# EAGLE design datalogger_v01 (EAGLE 7.2.0)
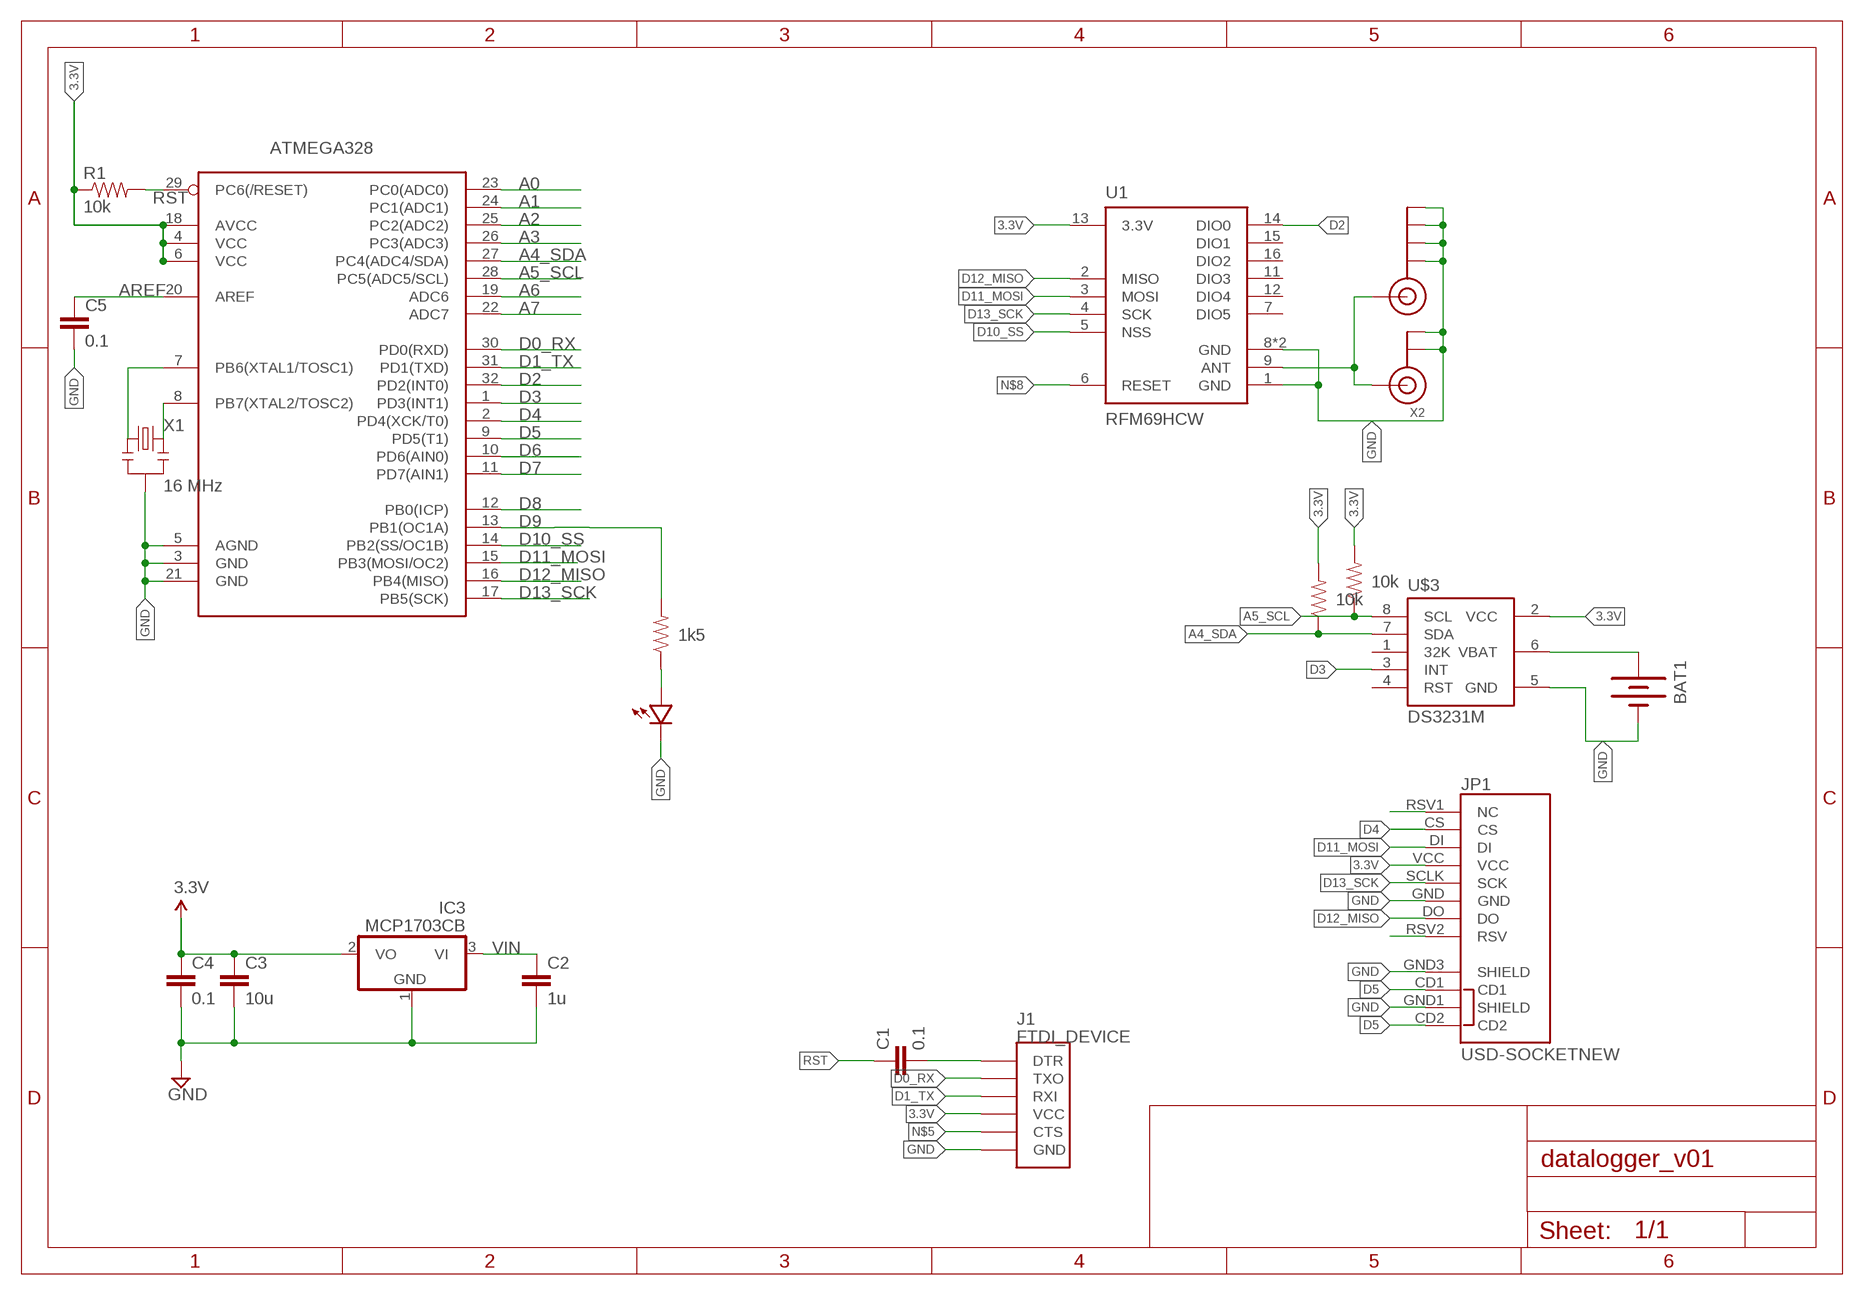
[diagram p0: schematic, sheet 1]

## Parts
ATMEGA328  ATMega-328  ATMEGA168/328TQFP32  [TQFP32-08]
BAT1  BATTERY12MM  [BATTCON_12MM]
C1  0.1  CAP0603-CAP  [0603-CAP]
C2  1u  CAP0603-CAP  [0603-CAP]
C3  10u  CAP0805-CAP  [0805-CAP]
C4  0.1  CAP0603-CAP  [0603-CAP]
C5  0.1  CAP0603-CAP  [0603-CAP]
IC3  MCP1703CB  [SOT23]
J1  FTDI_DEVICE  [FTDI_DEVICE_SIDE]
J$1  SMA_EDGE  [SMA-EDGE]
JP1  USD-SOCKETNEW  [MICRO-SD-SOCKET-PP]
R1  10k  RESISTOR0603-RES  [0603-RES]
R2  1k5  RESISTOR0603-RES  [0603-RES]
R3  10k  RESISTOR0603-RES  [0603-RES]
R4  10k  RESISTOR0603-RES  [0603-RES]
U1  RFM69HCW  [RFM69HCW-XXXS2]
U$2  LED0603  [0603-LED]
U$3  DS3231M  [SO08]
X1  16 MHz  RESONATORSMD  [RESONATOR-SMD]
X2  ANTENNA_U.FL  [U.FL]

## Nets
3.3V: ATMEGA328.4(VCC) ATMEGA328.6(VCC) ATMEGA328.18(AVCC) J1.P$4(VCC) JP1.VCC R1.1 R3.2 R4.2 U1.13(3.3V) U$3.2(VCC)
A0: ATMEGA328.23(PC0(ADC0))
A1: ATMEGA328.24(PC1(ADC1))
A2: ATMEGA328.25(PC2(ADC2))
A3: ATMEGA328.26(PC3(ADC3))
A4_SDA: ATMEGA328.27(PC4(ADC4/SDA)) R4.1 U$3.7(SDA)
A5_SCL: ATMEGA328.28(PC5(ADC5/SCL)) R3.1 U$3.8(SCL)
A6: ATMEGA328.19(ADC6)
A7: ATMEGA328.22(ADC7)
AREF: ATMEGA328.20(AREF) C5.1
D0_RX: ATMEGA328.30(PD0(RXD)) J1.P$2(TXO)
D1_TX: ATMEGA328.31(PD1(TXD)) J1.P$3(RXI)
D2: ATMEGA328.32(PD2(INT0)) U1.14(DIO0)
D3: ATMEGA328.1(PD3(INT1)) U$3.3(INT)
D4: ATMEGA328.2(PD4(XCK/T0)) JP1.CS
D5: ATMEGA328.9(PD5(T1)) JP1.CD1 JP1.CD2
D6: ATMEGA328.10(PD6(AIN0))
D7: ATMEGA328.11(PD7(AIN1))
D8: ATMEGA328.12(PB0(ICP))
D9: ATMEGA328.13(PB1(OC1A)) R2.2
D10_SS: ATMEGA328.14(PB2(SS/OC1B)) U1.5(NSS)
D11_MOSI: ATMEGA328.15(PB3(MOSI/OC2)) JP1.DI U1.3(MOSI)
D12_MISO: ATMEGA328.16(PB4(MISO)) JP1.DO U1.2(MISO)
D13_SCK: ATMEGA328.17(PB5(SCK)) JP1.SCLK(SCK) U1.4(SCK)
GND [power]: ATMEGA328.3(GND) ATMEGA328.5(AGND) ATMEGA328.21(GND) BAT1.GND(-) C2.2 C3.2 C4.2 C5.2 IC3.1(GND) J1.P$6(GND) J$1.GND@0(GND) J$1.GND@1(GND) J$1.GND@2(GND) J$1.GND@3(GND) JP1.GND JP1.GND1(SHIELD) JP1.GND3(SHIELD) U1.1(GND) U1.8(GND) U1.10(GND) U$2.MINUS U$3.5(GND) X1.2 X2.1(GND) X2.2(GND)
N$1: ATMEGA328.7(PB6(XTAL1/TOSC1)) X1.1
N$2: R2.1 U$2.PLUS
N$3: JP1.RSV1(NC)
N$4: C1.2 J1.P$1(DTR)
N$5: J1.P$5(CTS)
N$8: U1.6(RESET)
N$10: BAT1.PWR@1(+) U$3.6(VBAT)
N$11: J$1.SIG(SIGNAL) U1.9(ANT) X2.3(SIGNAL)
N$13: JP1.RSV2(RSV)
N$21: ATMEGA328.8(PB7(XTAL2/TOSC2)) X1.3
RST: ATMEGA328.29(PC6(/RESET)) C1.1 R1.2
VCC: C3.1 C4.1 IC3.2(VO) ; supply symbol labelled 3.3V
VIN: C2.1 IC3.3(VI)
Unconnected: U1.7(DIO5) U1.11(DIO3) U1.12(DIO4) U1.15(DIO1) U1.16(DIO2) U$3.1(32K) U$3.4(RST)

## Library data of the parts
ATMEGA328 = LowPowerLab:ATMEGA168/328: Atmel 32-pin 8-bit micro, 16k flash.
BAT1 = SparkFun-Electromechanical:BATTERY: Battery Holders Various common sizes : AA, AAA, 18650 (PRT-12895), 20mm coin cell and 12mm coin cell. 20MM_4LEGS, BATT-10373; PROD_ID: BATT-08044
C1-C5 = LowPowerLab:CAP: Capacitor Standard 0603 ceramic capacitor, and 0.1" leaded capacitor.
IC3 = linear:MCP1703: 250 mA, 16V, Low Quiescent Current LDO Regulator Source: http://ww1.microchip.com/downloads/en/DeviceDoc/22049b.pdf
J1 = SparkFun-Connectors:FTDI_DEVICE: Connector which mates to FTDI basic or FTDI cable.
J$1 = SparkFun-Connectors:SMA_EDGE: SMA Antenna Connector End launch SMA connector. The paste layer has been removed so that the connector can be hand soldered onto the board after reflow.
JP1 = SparkFun-Connectors:USD-SOCKET: microSD Socket Push-push type uSD socket. Schematic element and footprint production proven. Spark Fun Electronics SKU : PRT-00127. tDoc lines correctly indicate media card edge positions when inserting (unlocked, locked, depressed). NOTE: CD1 and CD2 are connected internally; PROD_ID: CONN-07820
R1-R4 = LowPowerLab:RESISTOR: Resistor Basic schematic elements and footprints for 0603, 1206, and PTH resistors.
U1 = SparkFun-RF:RFM69H; PROD_ID: IC-11997, IC-12053
U$2 = LowPowerLab:LED
U$3 = _my-parts:DS3231M: The DS3231M is a low-cost, extremely accurate, I2C realtime clock (RTC). Datasheet <https://datasheets.maximintegrated.com/en/ds/DS3231M.pdf>
X1 = SparkFun:RESONATOR: Resonator Small SMD resonator. This is the itty bitty 10/20MHz resonators with built in caps. CSTCE10M0G55 and CSTCE20M0V53. Footprint has been reviewed closely but hasn't been tested yet.
X2 = adafruit:ANTENNA_U.FL: U.FL Antenna Connector

## Net classes
1 power: width 0.381 mm, clearance 0.254 mm

## Board
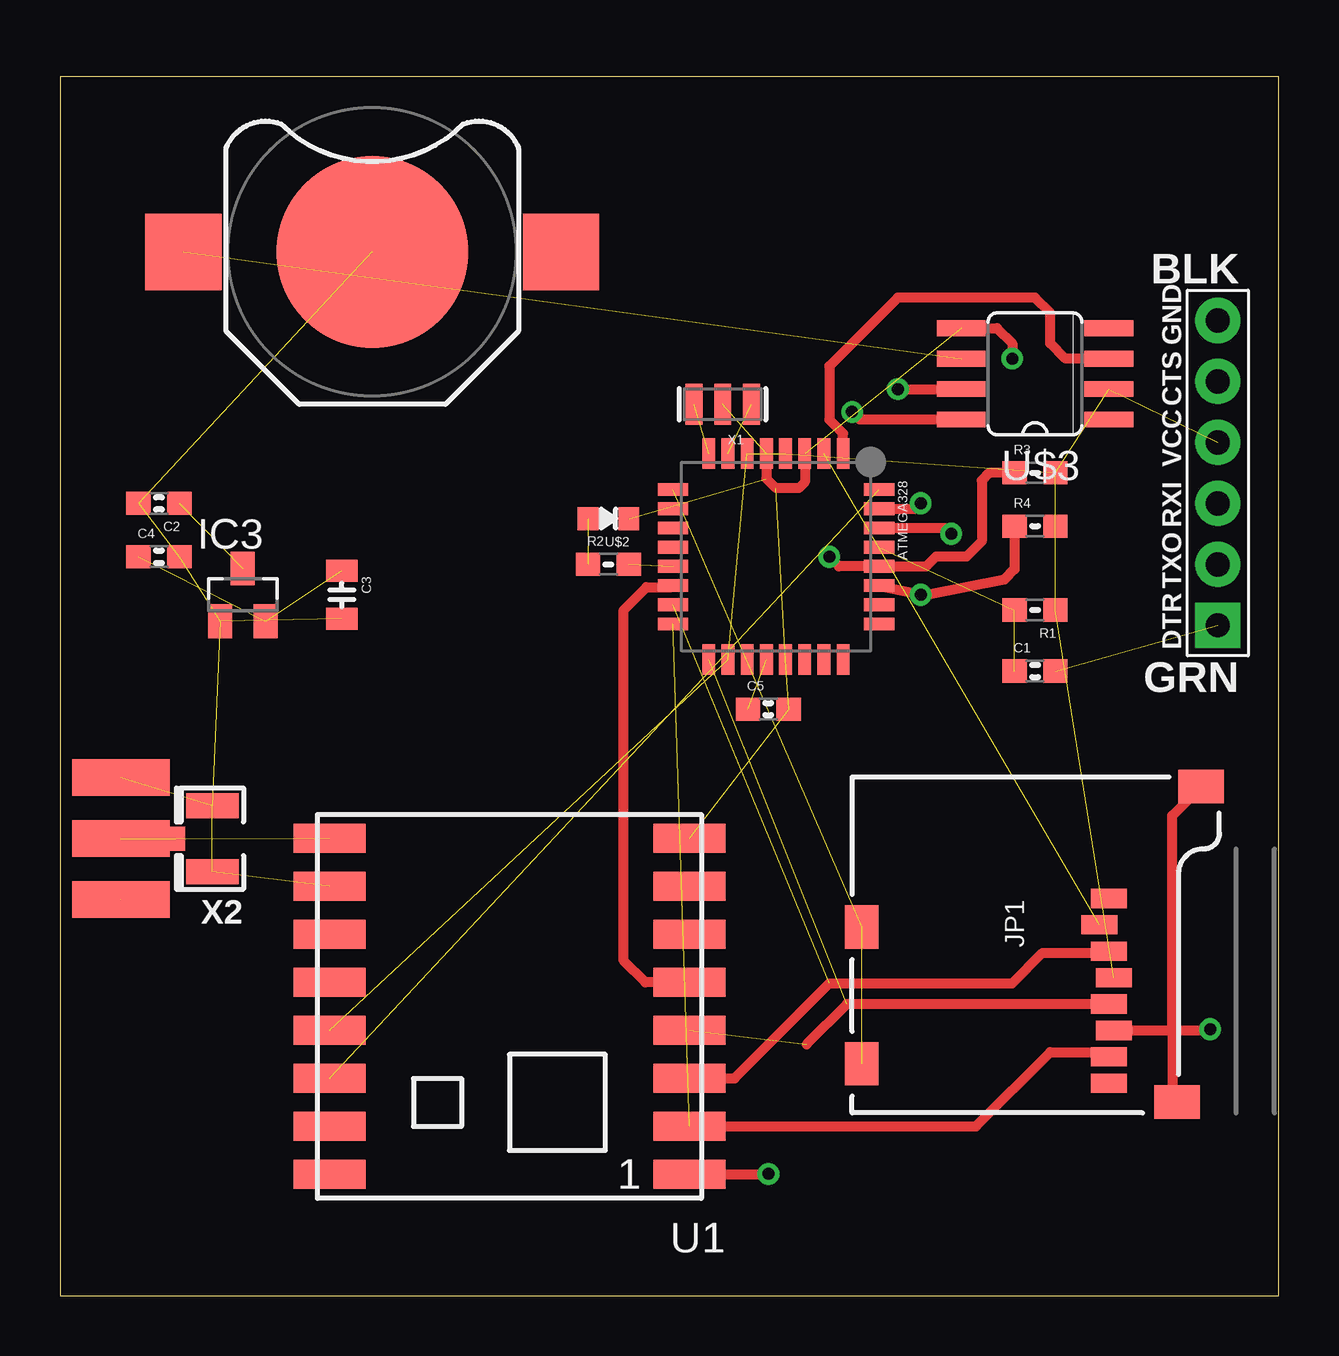
[diagram p1: board, top side]
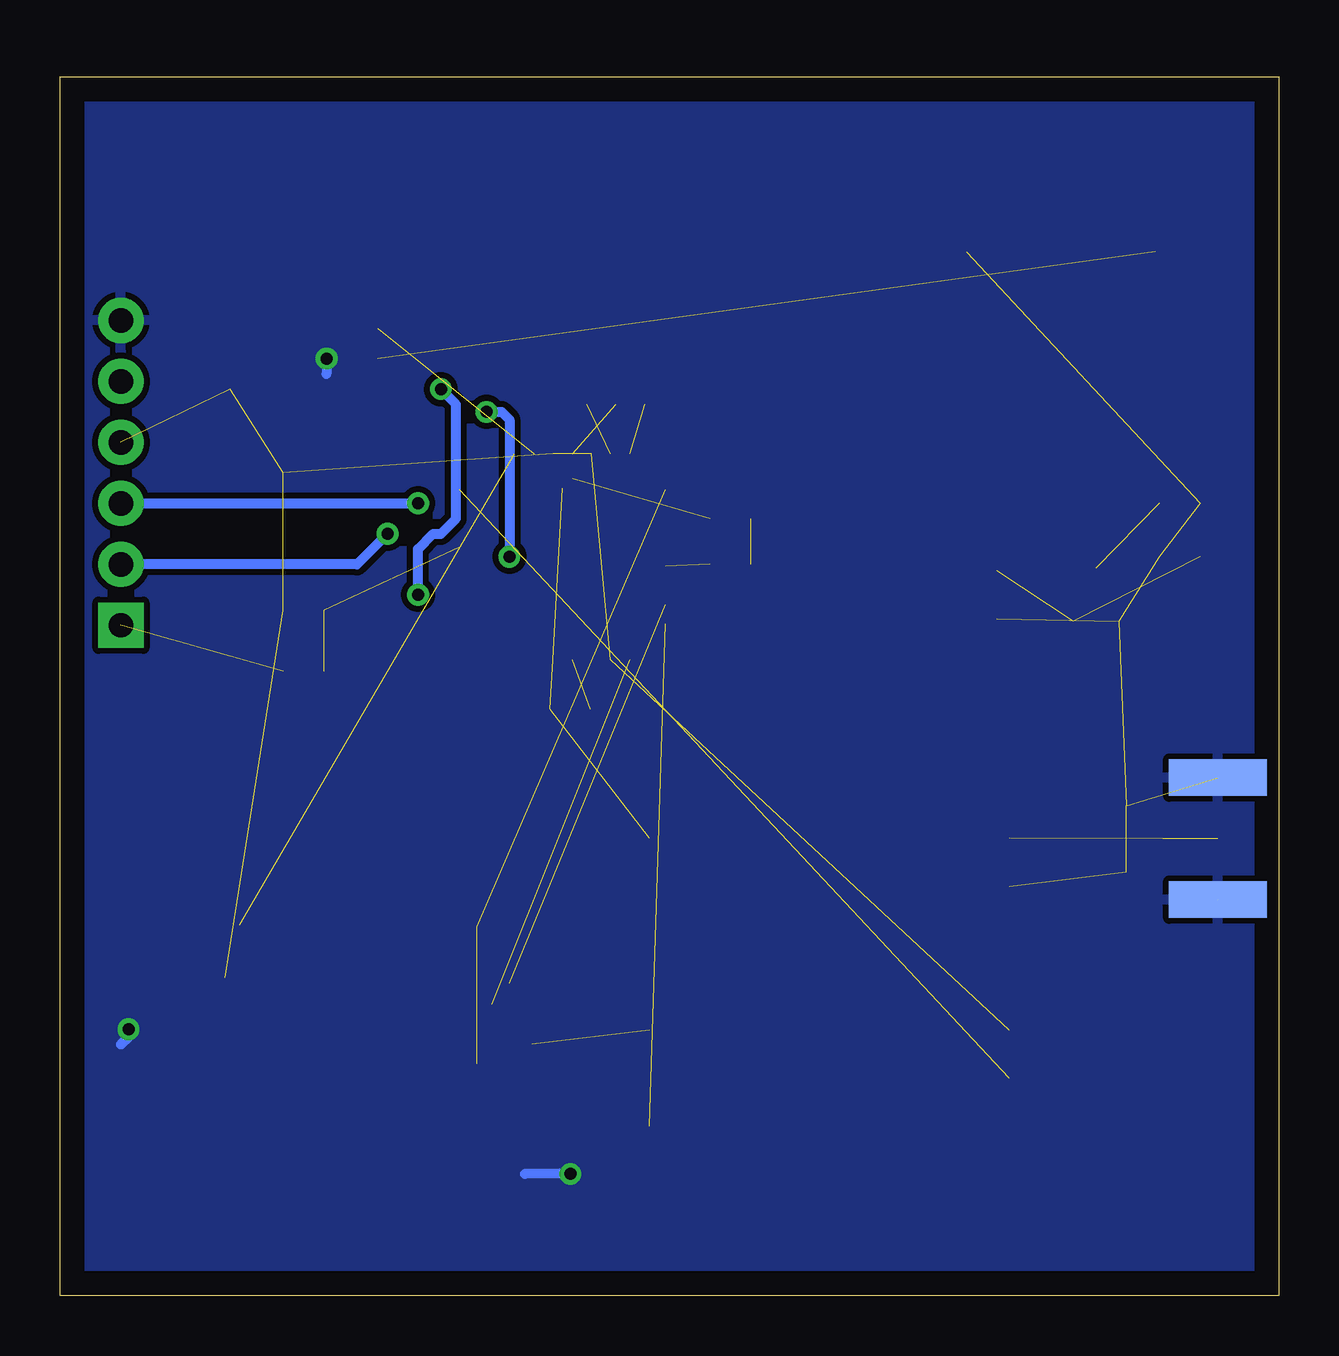
[diagram p2: board, bottom side, seen from below]

Size 50.8 x 50.8 mm. Coordinates in mm from the lower left corner, seen from the top.
Outline: 0,0 50.8,0 50.8,50.8 0,50.8 0,0
Copper layers (1*16): Top 0.035mm / dielectric 1.5mm / Bottom 0.035mm
Design rules "default": minimum track width 10mil, minimum drill 24mil, track to track 8mil, track to pad 8mil, pad to pad 8mil, via to via 8mil, smd to smd 8mil, copper to edge 40mil, drill to drill 8mil, minimum pad ring 10mil, minimum via ring 8mil, stop-mask expansion 4mil, vias tented up to drill 0mil, thermal gap 10mil

### Footprints (pad centres in the part's own frame; a part is rotated, then mirrored left to right if it is on the bottom)
TQFP32-08 = smd 1.27 x 0.533: 1 -4.293,2.8; 2 -4.293,2; 3 -4.293,1.2; 4 -4.293,0.4; 5 -4.293,-0.4; 6 -4.293,-1.2; 7 -4.293,-2; 8 -4.293,-2.8; 17 4.293,-2.8; 18 4.293,-2; 19 4.293,-1.2; 20 4.293,-0.4; 21 4.293,0.4; 22 4.293,1.2; 23 4.293,2; 24 4.293,2.8 | smd 0.533 x 1.27: 9 -2.8,-4.293; 10 -2,-4.293; 11 -1.2,-4.293; 12 -0.4,-4.293; 13 0.4,-4.293; 14 1.2,-4.293; 15 2,-4.293; 16 2.8,-4.293; 25 2.8,4.293; 26 2,4.293; 27 1.2,4.293; 28 0.4,4.293; 29 -0.4,4.293; 30 -1.2,4.293; 31 -2,4.293; 32 -2.8,4.293
BATTCON_12MM = smd 8 x 8: GND 0,0 | smd 3.175 x 3.175: PWR@1 -7.874,0; PWR@2 7.874,0
0603-CAP = smd 1.016 x 0.965: 1 -0.85,0; 2 0.85,0
0805-CAP = smd 0.902 x 1.3: 1 -1,0; 2 1,0
SOT23 = smd 1 x 1.4: 1 -0.95,-1.1; 2 0.95,-1.1; 3 0,1.1
FTDI_DEVICE_SIDE = drill 1.016 pad 1.88 square: P$1 -6.35,0 | drill 1.016 pad 1.88: P$2 -3.81,0; P$3 -1.27,0; P$4 1.27,0; P$5 3.81,0; P$6 6.35,0
SMA-EDGE = smd 1.524 x 4.064: GND@0 0,0; GND@1 5.08,0; SIG 2.54,0 | smd 1.524 x 4.064 bottom: GND@2 0,0; GND@3 5.08,0
MICRO-SD-SOCKET-PP = smd 1.8 x 1.4: CD1 -2.05,0.4; CD2 -7.75,0.4 | smd 0.8 x 1.5: CS -7.84,10.3; DI -6.74,10.7; DO -2.34,10.7; GND -3.44,10.9; RSV1 -8.94,10.7; RSV2 -1.24,10.7; SCLK -4.54,10.7; VCC -5.64,10.9 | smd 1.4 x 1.9: GND1 -13.6,14.55; GND3 -0.45,13.55
0603-RES = smd 1.016 x 0.965: 1 -0.85,0; 2 0.85,0
RFM69HCW-XXXS2 = smd 3 x 1.2: 1 -7.5,7; 2 -7.5,5; 3 -7.5,3; 4 -7.5,1; 5 -7.5,-1; 6 -7.5,-3; 7 -7.5,-5; 8 -7.5,-7; 9 7.5,-7; 10 7.5,-5; 11 7.5,-3; 12 7.5,-1; 13 7.5,1; 14 7.5,3; 15 7.5,5; 16 7.5,7
0603-LED = smd 0.864 x 0.965: MINUS -0.85,0; PLUS 0.85,0
SO08 = smd 0.66 x 2.032: 1 -1.905,-3.073; 2 -0.635,-3.073; 3 0.635,-3.073; 4 1.905,-3.073; 5 1.905,3.073; 6 0.635,3.073; 7 -0.635,3.073; 8 -1.905,3.073
RESONATOR-SMD = smd 0.7 x 1.7: 1 -1.2,0; 2 0,0; 3 1.2,0
U.FL = smd 2.2 x 1.05: 1 0,1.375; 2 0,-1.375 | smd 0.8 x 1: 3 1.525,0

### Placement (x,y rotation side)
ATMEGA328  29.84,30.8 270 top
BAT1  13.02,43.5 0 top
C1  40.64,26.04 0 top
C2  4.13,33.02 180 top
C3  11.75,29.21 270 top
C4  4.13,30.8 0 top
C5  29.53,24.45 0 top
IC3  7.62,29.21 0 top
J1  48.26,34.29 90 top
J$1  2.54,16.51 90 top
JP1  33.02,7.62 270 top
R1  40.64,28.57 180 top
R2  22.86,30.48 0 top
R3  40.64,34.29 0 top
R4  40.64,32.07 0 top
U1  18.73,12.06 180 top
U$2  22.86,32.38 180 top
U$3  40.64,38.42 90 top
X1  27.62,37.15 180 top
X2  6.35,19.05 180 top

### Tracks (layer width: path | path; a pad name or v marks a point on that pad's centre or on a via)
3.3V  (9 unrouted)
A4_SDA  (via drill 0.5)
  Top 0.406: ATMEGA328.27 35.63,29.28 v35.88,29.21 36.2,29.21 39.37,29.84 39.79,30.27 R4.1 | v34.92,37.78 U$3.7
  Bottom 0.406: v35.88,29.21 35.88,31.11 35.24,31.75 34.92,31.75 34.29,32.38 34.29,37.15 v34.92,37.78
A5_SCL  (via drill 0.5)
  Top 0.406: U$3.8 33.34,36.51 v33.02,36.83 | v32.07,30.8 32.47,30.4 ATMEGA328.28 36.11,30.4 36.51,30.8 37.78,30.8 38.42,31.43 38.42,33.97 38.73,34.29 R3.1
  Bottom 0.406: v33.02,36.83 32.38,36.83 32.07,36.51 v32.07,30.8
AREF  (1 unrouted)
D0_RX  (via drill 0.5)
  Top 0.406: ATMEGA328.30 36.9,32 v37.15,31.75
  Bottom 0.406: v37.15,31.75 38.42,30.48 J1.P$2
D1_TX  (via drill 0.5)
  Top 0.406: ATMEGA328.31 35.66,32.8 v35.88,33.02
  Bottom 0.406: J1.P$3 v35.88,33.02
D2  (1 unrouted)
D3
  Top 0.406: ATMEGA328.1 32.65,35.94 32.07,36.51 32.07,38.73 34.92,41.59 40.64,41.59 41.27,40.96 41.27,39.69 41.91,39.05 U$3.3
D4  (1 unrouted)
D5  (2 unrouted)
D9  (1 unrouted)
D10_SS
  Top 0.406: U1.5 24.4,13.06 23.5,13.97 23.5,28.57 24.45,29.53 25.48,29.53 ATMEGA328.14
D11_MOSI  (1 unrouted)
  Top 0.406: U1.3 28.11,9.06 32.07,13.02 39.69,13.02 40.96,14.29 43.65,14.29 JP1.DI
D12_MISO  (1 unrouted)
  Top 0.406: U1.2 38.18,7.07 41.27,10.16 43.52,10.16 JP1.DO
D13_SCK  (2 unrouted)
  Top 0.406: JP1.SCLK 32.8,12.16 31.11,10.48
GND  (via drill 0.5)  (16 unrouted)
  Top 0.406: U$3.5 39.05,40.32 39.69,39.69 v39.69,39.05 | ATMEGA328.3 31.05,33.9 30.8,33.66 29.84,33.66 29.45,34.05 ATMEGA328.5 | U1.1 29.51,5.07 v29.53,5.08 | 46.35,11.11 46.3,11.06 JP1.GND 47.89,11.06 v47.94,11.11 | 46.35,11.11 46.35,8.29 JP1.GND3 | 46.35,11.11 46.35,20 JP1.GND1
  Bottom 0.406: v39.69,39.05 39.69,38.42 | v29.53,5.08 31.43,5.08 | v47.94,11.11 47.94,10.79 48.26,10.48
  pour Bottom: 0,0 50.8,0 50.8,50.8 0,50.8
N$1  (1 unrouted)
N$2  (1 unrouted)
N$4  (1 unrouted)
N$10  (1 unrouted)
N$11  (2 unrouted)
N$21  (1 unrouted)
RST  (2 unrouted)
VCC  (2 unrouted)
VIN  (1 unrouted)